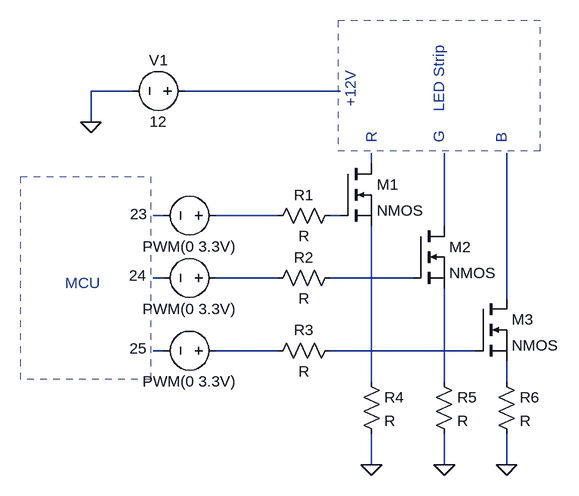
[diagram p0: schematic LEDStripSchematic.asc]
LEDStripSchematic.asc, the LTspice schematic file:
Version 4
SHEET 1 928 720
WIRE 16 128 -48 128
WIRE 336 128 96 128
WIRE -48 176 -48 128
WIRE 384 240 384 224
WIRE 64 320 48 320
WIRE 240 320 144 320
WIRE 336 320 320 320
WIRE 496 336 496 224
WIRE 64 416 48 416
WIRE 240 416 144 416
WIRE 448 416 320 416
WIRE 592 448 592 224
WIRE 64 528 48 528
WIRE 240 528 144 528
WIRE 544 528 320 528
WIRE 384 576 384 336
WIRE 496 576 496 432
WIRE 592 576 592 544
WIRE 384 704 384 656
WIRE 496 704 496 656
WIRE 592 704 592 656
FLAG -48 176 0
FLAG 384 704 0
FLAG 496 704 0
FLAG 592 704 0
SYMBOL voltage 112 128 R90
WINDOW 0 -32 56 VBottom 2
WINDOW 3 32 56 VTop 2
SYMATTR InstName V1
SYMATTR Value 12
SYMBOL res 336 304 R90
WINDOW 0 0 56 VBottom 2
WINDOW 3 32 56 VTop 2
SYMATTR InstName R1
SYMBOL res 336 400 R90
WINDOW 0 0 56 VBottom 2
WINDOW 3 32 56 VTop 2
SYMATTR InstName R2
SYMBOL res 336 512 R90
WINDOW 0 0 56 VBottom 2
WINDOW 3 32 56 VTop 2
SYMATTR InstName R3
SYMBOL res 368 560 R0
SYMATTR InstName R4
SYMBOL res 480 560 R0
SYMATTR InstName R5
SYMBOL res 576 560 R0
SYMATTR InstName R6
SYMBOL nmos 336 240 R0
SYMATTR InstName M1
SYMBOL nmos 448 336 R0
SYMATTR InstName M2
SYMBOL nmos 544 448 R0
SYMATTR InstName M3
SYMBOL voltage 160 320 R90
WINDOW 0 13 134 VBottom 2
WINDOW 3 32 56 VTop 2
SYMATTR InstName 23
SYMATTR Value PWM(0 3.3V)
SYMBOL voltage 160 416 R90
WINDOW 0 12 136 VBottom 2
WINDOW 3 32 56 VTop 2
SYMATTR InstName 24
SYMATTR Value PWM(0 3.3V)
SYMBOL voltage 160 528 R90
WINDOW 0 12 135 VBottom 2
WINDOW 3 32 56 VTop 2
SYMATTR InstName 25
SYMATTR Value PWM(0 3.3V)
TEXT 488 160 VLeft 2 ;LED Strip
TEXT 384 208 VLeft 2 ;R
TEXT 488 208 VLeft 2 ;G
TEXT 584 208 VLeft 2 ;B
TEXT 352 152 VLeft 2 ;+12V
TEXT -88 424 Left 2 ;MCU
RECTANGLE Normal 332 220 644 20 2
RECTANGLE Normal -156 260 44 572 2

The netlist it stands for:
* LEDStripSchematic.asc
V1 N001 0 12
R1 N005 N004 R
R2 N009 N008 R
R3 N013 N012 R
R4 N014 0 R
R5 N015 0 R
R6 N016 0 R
M1 N002 N005 N014 N014 NMOS
M2 N006 N009 N015 N015 NMOS
M3 N010 N013 N016 N016 NMOS
V§23 N004 N003 PWM(0 3.3V)
V§24 N008 N007 PWM(0 3.3V)
V§25 N012 N011 PWM(0 3.3V)
.model NMOS NMOS
.model PMOS PMOS
.lib standard.mos
* LED Strip
* R
* G
* B
* +12V
* MCU
.backanno
.end